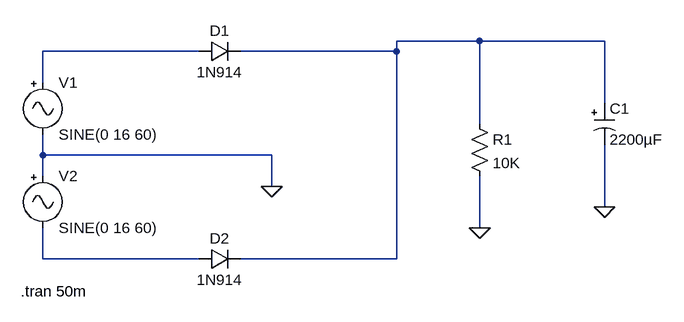
[diagram p0: schematic 2_2-1.asc]
2_2-1.asc, the LTspice schematic file:
Version 4
SHEET 1 880 680
WIRE 288 112 160 112
WIRE 480 112 288 112
WIRE -144 128 -384 128
WIRE 160 128 160 112
WIRE 160 128 -80 128
WIRE -384 176 -384 128
WIRE 480 208 480 112
WIRE 288 240 288 112
WIRE -384 288 -384 256
WIRE -32 288 -384 288
WIRE -384 320 -384 288
WIRE -32 336 -32 288
WIRE 480 368 480 272
WIRE 288 400 288 320
WIRE -384 448 -384 400
WIRE -144 448 -384 448
WIRE 160 448 160 128
WIRE 160 448 -80 448
FLAG -32 336 0
FLAG 288 400 0
FLAG 480 368 0
SYMBOL Misc\\signal -384 160 R0
SYMATTR InstName V1
SYMATTR Value SINE(0 16 60)
SYMBOL Misc\\signal -384 304 R0
SYMATTR InstName V2
SYMATTR Value SINE(0 16 60)
SYMBOL diode -144 144 R270
WINDOW 0 32 32 VTop 2
WINDOW 3 0 32 VBottom 2
SYMATTR InstName D1
SYMATTR Value 1N914
SYMBOL diode -144 464 R270
WINDOW 0 32 32 VTop 2
WINDOW 3 0 32 VBottom 2
SYMATTR InstName D2
SYMATTR Value 1N914
SYMBOL res 272 224 R0
SYMATTR InstName R1
SYMATTR Value 10K
SYMBOL polcap 464 208 R0
SYMATTR InstName C1
SYMATTR Value 2200µF
TEXT -418 498 Left 2 !.tran 50m

The netlist it stands for:
* 2_2-1.asc
V1 N002 0 SINE(0 16 60)
V2 0 N003 SINE(0 16 60)
D1 N002 N001 1N914
D2 N003 N001 1N914
R1 N001 0 10K
C1 N001 0 2200µF
.model D D
.lib standard.dio
.tran 50m
.backanno
.end